# Altium schematic sheet BW1098OBC_Power_Supply.SchDoc: =project_title
size Tabloid; PageSetup: Record=PageOptions|CenterHorizontal=True|CenterVertical=True|PrintScale=0.73|XCorrection=1.00|YCorrection=1.00|PrintKind=0|BorderSize=5000000|LeftOffset=0|BottomOffset=0|Orientation=2|PaperLength=1000|PaperWidth=1000|Scale=100|PaperSource=7|PrintQuality=-4|MediaType=1|DitherType=10|PaperKind=A4|PrintScaleMode=1; CompanyName: Luxonis Holding; Organization: Luxonis Holding; Address1: 1925 Harmony Park Drive; Address2: Westminster, CO; Address3: 80234; Address4: United States; SheetNumber: 5; SheetTotal: 8
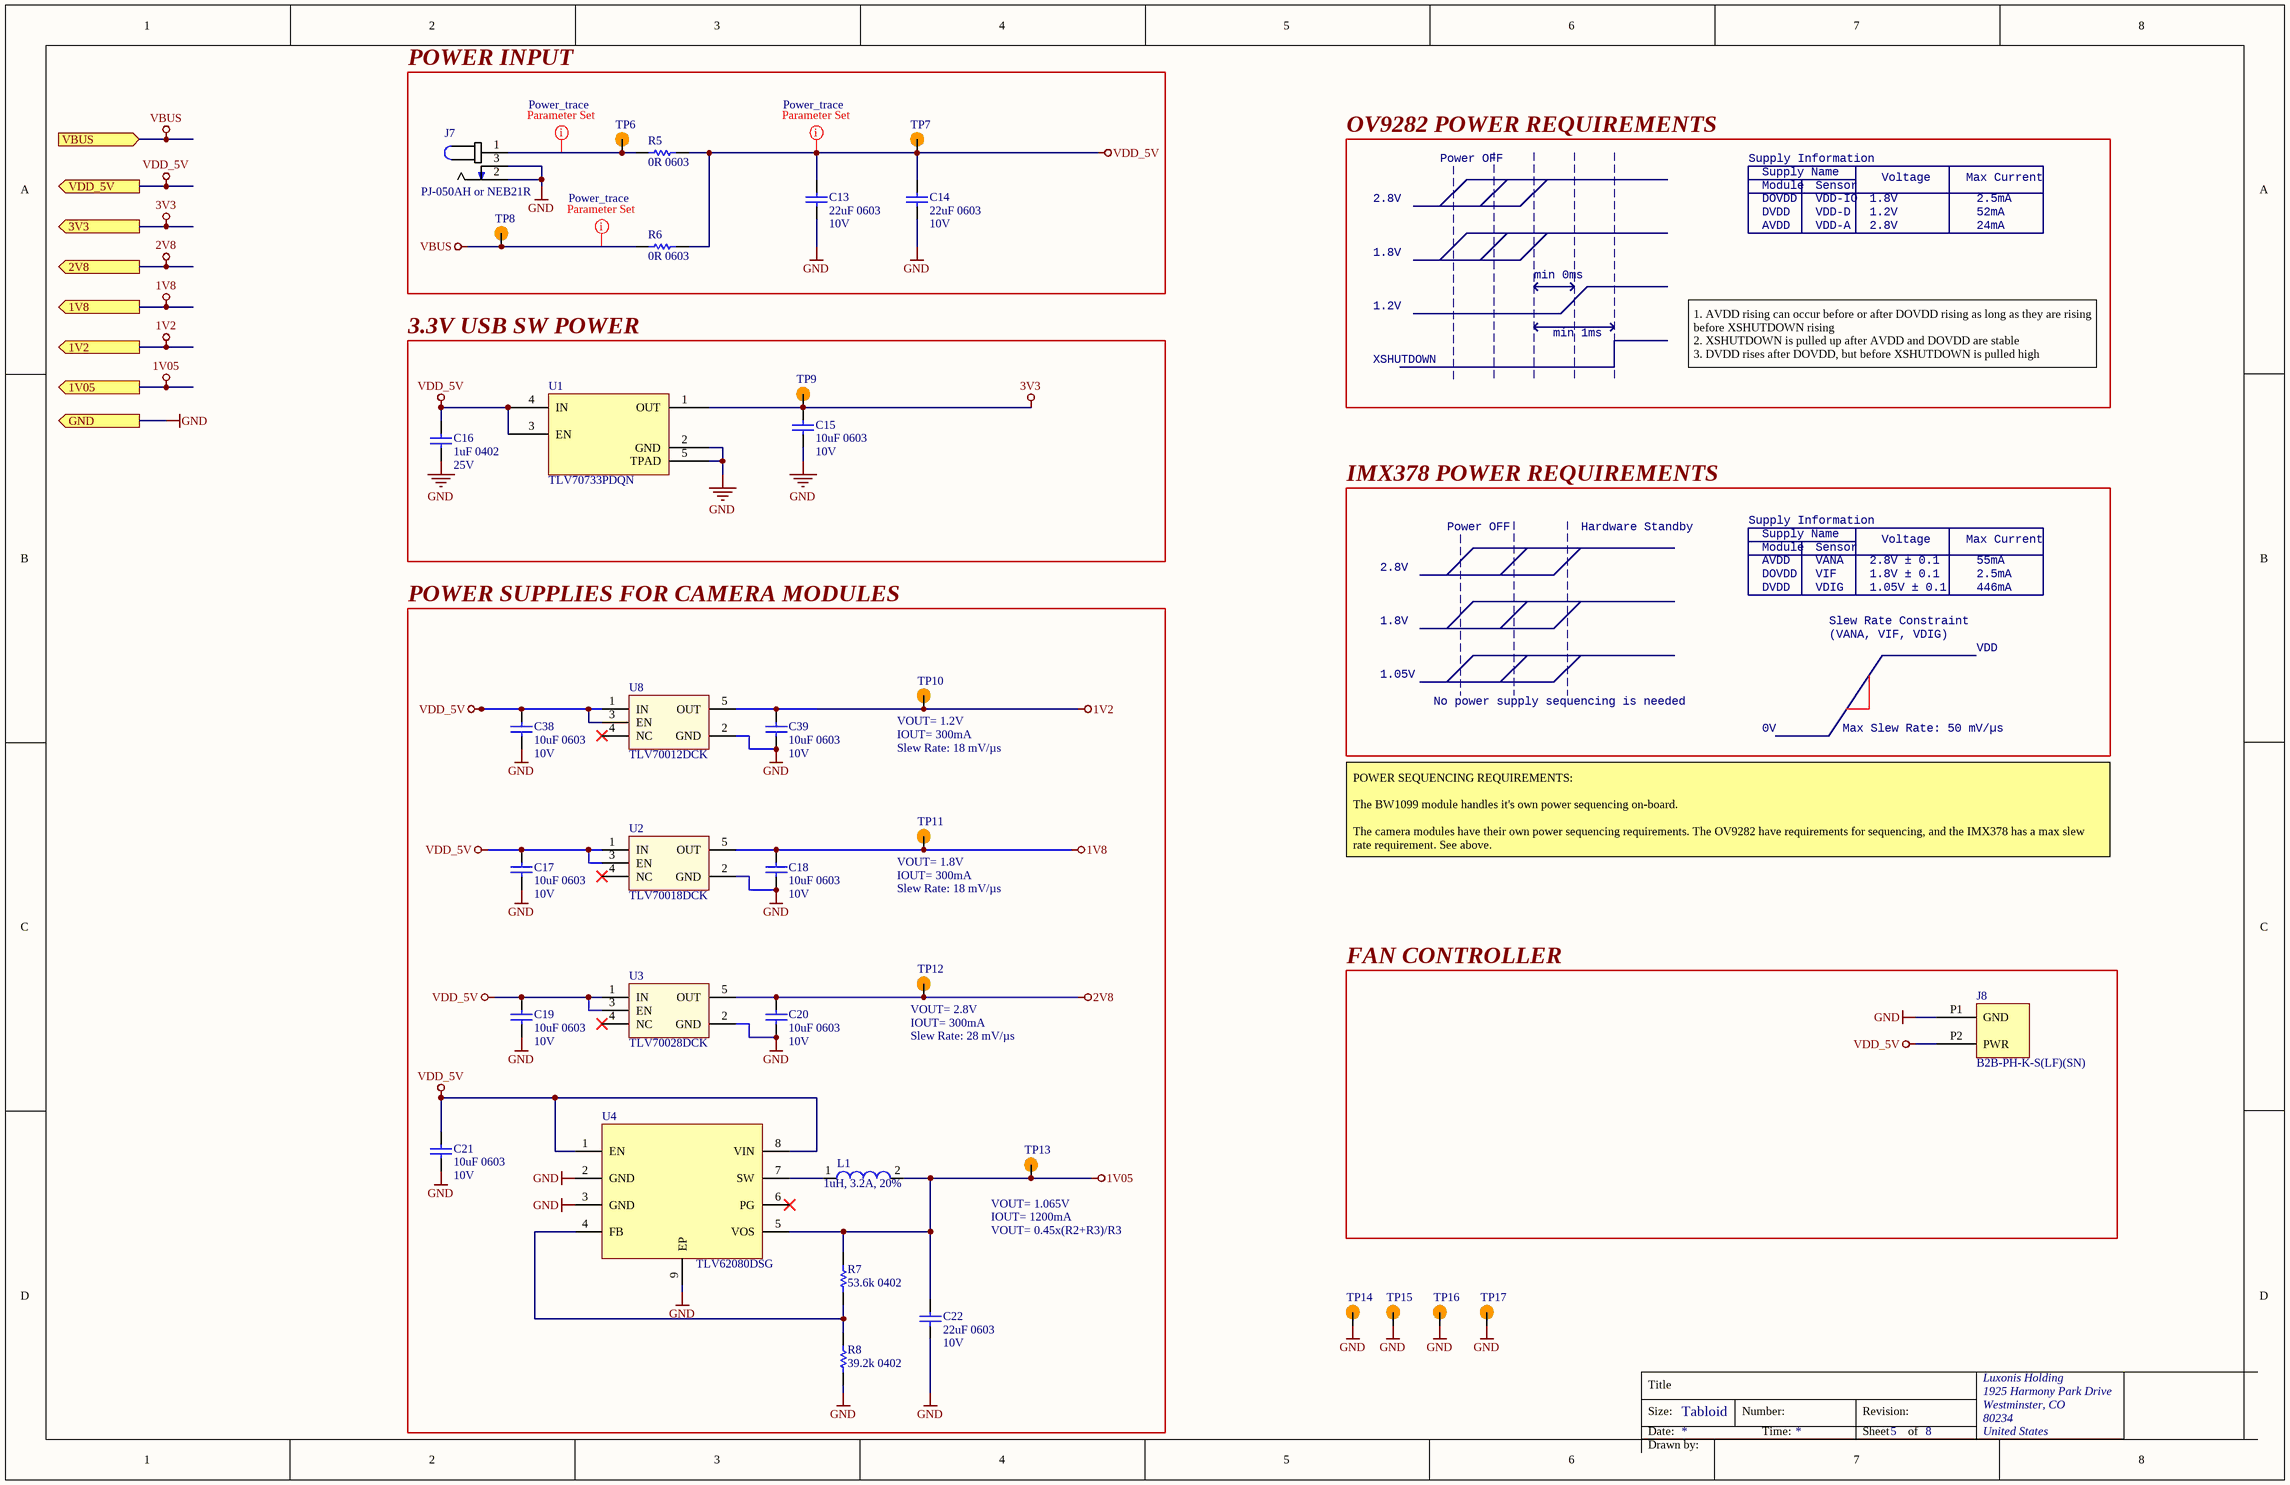
[diagram p0: BW1098OBC_Power_Supply.SchDoc]

## Parts
C13  22uF 0603  Voltage Rating: 10V  [CAPC0603(1608)100_L]
C14  22uF 0603  Voltage Rating: 10V  [CAPC0603(1608)100_L]
C15  10uF 0603  Voltage Rating: 10V  [CAPC0603(1608)100_L]
C16  1uF 0402  Voltage Rating: 25V  [CAPC0402(1005)70_L]
C17  10uF 0603  Voltage Rating: 10V  [CAPC0603(1608)100_L]
C18  10uF 0603  Voltage Rating: 10V  [CAPC0603(1608)100_L]
C19  10uF 0603  Voltage Rating: 10V  [CAPC0603(1608)100_L]
C20  10uF 0603  Voltage Rating: 10V  [CAPC0603(1608)100_L]
C21  10uF 0603  Voltage Rating: 10V  [CAPC0603(1608)100_L]
C22  22uF 0603  Voltage Rating: 10V  [CAPC0603(1608)100_L]
C38  10uF 0603  Voltage Rating: 10V  [CAPC0603(1608)100_L]
C39  10uF 0603  Voltage Rating: 10V  [CAPC0603(1608)100_L]
J7  PJ-050AH or NEB21R  [PJ-050AH/NEB21R_COMBO]
J8  B2B-PH-K-S(LF)(SN)  [B2B-PH-K-S(LF)(SN)]
L1  1uH, 3.2A, 20%  [DFE252012P-1R0M=P2]
R5  0R 0603  [RESC0603(1608)_N]
R6  0R 0603  [RESC0603(1608)_N]
R7  53.6k 0402  [RESC0402(1005)_L]
R8  39.2k 0402  [RESC0402(1005)_L]
TP6  TP100_200_NS  [TP100_200_NS]  (value not drawn)  (no BOM)
TP7  TP100_200_NS  [TP100_200_NS]  (value not drawn)  (no BOM)
TP8  TP100_200_NS  [TP100_200_NS]  (value not drawn)  (no BOM)
TP9  TP100_200_NS  [TP100_200_NS]  (value not drawn)  (no BOM)
TP10  TP100_200_NS  [TP100_200_NS]  (value not drawn)  (no BOM)
TP11  TP100_200_NS  [TP100_200_NS]  (value not drawn)  (no BOM)
TP12  TP100_200_NS  [TP100_200_NS]  (value not drawn)  (no BOM)
TP13  TP100_200_NS  [TP100_200_NS]  (value not drawn)  (no BOM)
TP14  TP100_200_NS  [TP100_200_NS]  (value not drawn)  (no BOM)
TP15  TP100_200_NS  [TP100_200_NS]  (value not drawn)  (no BOM)
TP16  TP100_200_NS  [TP100_200_NS]  (value not drawn)  (no BOM)
TP17  TP100_200_NS  [TP100_200_NS]  (value not drawn)  (no BOM)
U1  TLV70733PDQN  [TLV70733PDQN]
U2  TLV70018DCK  [TLV70018DCK]
U3  TLV70028DCK  [TLV70028DCK]
U4  TLV62080DSG  [TLV62080DSG]
U8  TLV70012DCK  [TLV70012DCK]

## Blocks framed on the sheet
POWER INPUT: C13 C14 J7 R5 R6 TP6-TP8
3.3V USB SW POWER: C15 C16 TP9 U1
POWER SUPPLIES FOR CAMERA MODULES: C17-C22 C38 C39 L1 R7 R8 TP10-TP13 U2-U4 U8
FAN CONTROLLER: J8

## Ports
1V2 (out), 1V05 (out), 1V8 (out), 2V8 (out), 3V3 (out), GND (out), VBUS (in), VDD_5V (out)

## Nets
1V2: C39.2 TP10.1 U8.5(OUT) ; port 1V2
1V05: C22.2 L1.2 R7.2 TP13.1 U4.5(VOS) ; port 1V05
1V8: C18.2 TP11.1 U2.5(OUT) ; port 1V8
2V8: C20.2 TP12.1 U3.5(OUT) ; port 2V8
3V3: C15.2 TP9.1 U1.1(OUT) ; port 3V3
GND: C13.1 C14.1 C15.1 C16.1 C17.1 C18.1 C19.1 C20.1 C21.1 C22.1 C38.1 C39.1 J7.2 J7.3 J8.P1(GND) R8.1 TP14.1 TP15.1 TP16.1 TP17.1 U1.2(GND) U1.5(TPAD) U2.2(GND) U3.2(GND) U4.2(GND) U4.3(GND) U4.9(EP) U8.2(GND) ; port GND
VBUS: R6.1 TP8.1 ; port VBUS
VDD_5V: C13.2 C14.2 C16.2 C17.2 C19.2 C21.2 C38.2 J8.P2(PWR) R5.2 R6.2 TP7.1 U1.3(EN) U1.4(IN) U2.1(IN) U2.3(EN) U3.1(IN) U3.3(EN) U4.1(EN) U4.8(VIN) U8.1(IN) U8.3(EN) ; port VDD_5V
NetJ7_1: J7.1 R5.1 TP6.1
NetL1_1: L1.1 U4.7(SW)
NetR7_1: R7.1 R8.2 U4.4(FB)

Not connected (* = marked no-connect by the designer): U2 4(NC)*; U3 4(NC)*; U4 6(PG)*; U8 4(NC)*

## Layout directives
net class Power_trace: NetJ7_1, VBUS, VDD_5V

## Notes on the sheet
- OV9282 POWER REQUIREMENTS
- Power OFF
- Supply Information
- 2.8V
- AVDD
- DOVDD
- DVDD
- Supply Name
- Module
- VDD-A
- VDD-IO
- VDD-D
- Sensor
- 1.8V
- 1.2V
- Voltage
- Max Current
- 24mA
- 2.5mA
- 52mA
- min 0ms
- XSHUTDOWN
- min 1ms
- 1. AVDD rising can occur before or after DOVDD rising as long as they are rising before XSHUTDOWN rising
  2. XSHUTDOWN is pulled up after AVDD and DOVDD are stable
  3. DVDD rises after DOVDD, but before XSHUTDOWN is pulled high
- IMX378 POWER REQUIREMENTS
- Hardware Standby
- VANA
- 2.8V ± 0.1
- 55mA
- VIF
- VDIG
- Slew Rate Constraint
- 1.8V ± 0.1
- 1.05V ± 0.1
- 446mA
- 1.05V
- No power supply sequencing is needed
- (VANA, VIF, VDIG)
- VDD
- (near TP10) VOUT= 1.2V
- (near TP10) IOUT= 300mA
- (near TP10) Slew Rate: 18 mV/µs
- 0V
- Max Slew Rate: 50 mV/µs
- (near TP11) VOUT= 1.8V
- (near TP11) IOUT= 300mA
- (near TP11) Slew Rate: 18 mV/µs
- POWER SEQUENCING REQUIREMENTS:
  The BW1099 module handles it's own power sequencing on-board.
  The camera modules have their own power sequencing requirements. The OV9282 have requirements for sequencing, and the IMX378 has a max slew rate requirement. See above.
- (near TP12) VOUT= 2.8V
- (near TP12) IOUT= 300mA
- (near TP12) Slew Rate: 28 mV/µs
- (near TP13) VOUT= 1.065V
- (near TP13) IOUT= 1200mA
- VOUT= 0.45x(R2+R3)/R3
- Title
- Size:
- Date:
- Tabloid
- Number:
- Time:
- Revision:
- Sheet
- of
- Drawn by:

## Library data of the parts
C13 C14 C22 = GRM188R61A226ME15D: CAP CER 22UF 10V X5R 0603 20%; Manufacturer 1: Murata; Material: Ceramic; ComponentLink1URL: https://datasheet.ciiva.com/46444/1769893-46444975.pdf?src-supplier=Element14; ComponentLink1Description: https://datasheet.ciiva.com/46444/1769893-46444975.pdf?src-supplier=Element14; Supplier 1: Digi-Key; Manufacturer Part Number 1: GRM188R61A226ME15D; Stock 1: 984716; Pricing 1: 1=0.31000, 10=0.21500, 100=0.12160, 500=0.08584, 1000=0.07512 (USD); RoHS: Yes; Mount: Surface Mount; Case/Package: 0603; Weight: 0.000222oz; Case Code (Metric): 1608; Case Code (Imperial): 0603; Min Operating Temperature: -55°C; Max Operating Temperature: 85°C; Capacitance: 22uF; Tolerance: 20%; Packaging: Tape and Reel; Dielectric: X5R; Voltage Rating (DC): 10V; Termination: SMD/SMT; Package Quantity: 4000; Length: 1.6mm; Height: 0.8mm; Width: 0.8mm; Thickness: 0.039inch; Depth: 0.8mm; REACH SVHC: No SVHC; Lead Free: Lead Free; Supplier Part Number 1: 490-10476-1-ND
C15 C17-C21 C38 C39 = GRM188R61A106ME69D: CAP CER 10UF 10V X5R 0603 20%; Manufacturer 1: Murata; Material: Ceramic; Supplier 1: Digi-Key; Manufacturer Part Number 1: GRM188R61A106ME69D; Stock 1: 2873098; Pricing 1: 1=0.21000, 10=0.14100, 100=0.07130, 500=0.04876, 1000=0.04313 (USD); RoHS: Yes; Mount: Surface Mount; Case/Package: 0603; Weight: 0.000222oz; Case Code (Metric): 1608; Case Code (Imperial): 0603; Min Operating Temperature: -55°C; Max Operating Temperature: 85°C; Packaging: Tape and Reel; Tolerance: 20%; Capacitance: 10uF; Dielectric: X5R; Voltage Rating (DC): 10V; Package Quantity: 4000; Termination: SMD/SMT; Length: 1.6mm; Height: 0.8mm; Width: 0.8mm; Thickness: 0.035inch; Depth: 0.8mm; REACH SVHC: Unknown; Lead Free: Lead Free; ComponentLink1URL: http://www.mouser.com/ds/2/281/c02e-2905.pdf?src-supplier=Mouser; ComponentLink1Description: http://www.mouser.com/ds/2/281/c02e-2905.pdf?src-supplier=Mouser; ComponentLink2URL: http://components.arrow.com/part/dataview/0323_06119472?src-supplier=Arrow+Europe; ComponentLink2Description: http://components.arrow.com/part/dataview/0323_06119472?src-supplier=Arrow+Europe; ComponentLink3URL: http://www.farnell.com/datasheets/2048014.pdf?src-supplier=Farnell; ComponentLink3Description: http://www.farnell.com/datasheets/2048014.pdf?src-supplier=Farnell; ComponentLink4URL: http://www.farnell.com/datasheets/1872210.pdf?src-supplier=Farnell; ComponentLink4Description: http://www.farnell.com/datasheets/1872210.pdf?src-supplier=Farnell; ComponentLink5URL: http://search.murata.co.jp/Ceramy/image/img/A01X/G101/ENG/GRM188R61A106ME69-01.pdf?src-supplier=Digi-Key; ComponentLink5Description: http://search.murata.co.jp/Ceramy/image/img/A01X/G101/ENG/GRM188R61A106ME69-01.pdf?src-supplier=Digi-Key; ComponentLink6URL: http://www.farnell.com/datasheets/1872210.pdf?src-supplier=Newark; ComponentLink6Description: http://www.farnell.com/datasheets/1872210.pdf?src-supplier=Newark; ComponentLink7URL: http://www.farnell.com/datasheets/2048014.pdf?src-supplier=Element14; ComponentLink7Description: http://www.farnell.com/datasheets/2048014.pdf?src-supplier=Element14; ComponentLink8URL: http://www.farnell.com/datasheets/2048014.pdf?src-supplier=Newark; ComponentLink8Description: http://www.farnell.com/datasheets/2048014.pdf?src-supplier=Newark; Supplier Part Number 1: 490-10475-1-ND
C16 = GRM155R61E105KA12D: CAP CER 1UF 25V X5R 0402 10%; Manufacturer 1: Murata; Material: Ceramic; Supplier 1: Digi-Key; Manufacturer Part Number 1: GRM155R61E105KA12D; Stock 1: 200653; Pricing 1: 1=0.10000, 10=0.07100, 100=0.03350, 500=0.02352, 1000=0.01947, 2500=0.01812, 5000=0.01658 (USD); RoHS: Yes; Mount: Surface Mount; Case/Package: 0402; Weight: 0.000212oz; Case Code (Metric): 1005; Case Code (Imperial): 0402; Min Operating Temperature: -55°C; Max Operating Temperature: 85°C; Tolerance: 10%; Capacitance: 1uF; Dielectric: X5R; Voltage Rating (DC): 25V; Packaging: Tape and Reel; Package Quantity: 10000; Termination: SMD/SMT; Voltage: 25V; Length: 1mm; Height: 0.5mm; Width: 0.5mm; Thickness: 0.022inch; Depth: 0.5mm; Lead Free: Lead Free; REACH SVHC: No SVHC; ComponentLink1URL: https://datasheet.ciiva.com/22732/1666664-22732122.pdf?src-supplier=Element14; ComponentLink1Description: https://datasheet.ciiva.com/22732/1666664-22732122.pdf?src-supplier=Element14; ComponentLink2URL: https://datasheet.ciiva.com/7719/1666664-7719006.pdf?src-supplier=Element14; ComponentLink2Description: https://datasheet.ciiva.com/7719/1666664-7719006.pdf?src-supplier=Element14; Supplier Part Number 1: 490-10017-1-ND
J7 = PJ-050AH/NEB21R_COMBO: CONN POWER PIN 2 POS RA PTH Barrel jack 2.1mm x 5.5mm combo footprint; Manufacturer 1: CUI; Gender: Male; Shielding: Unshielded; Current Rating: 5A; Voltage Rating: 24V; Insulation Resistance: 100MR; Number of Conductors: 2; Max Current Rating: 3A; Voltage Rating (DC): 12V; Number of Ports: 1; Inside Diameter: 6mm; Supplier 1: Mouser; Manufacturer Part Number 1: PJ-050AH; Stock 1: 2665; Pricing 1: 1=0.78000, 10=0.68800, 50=0.62100, 100=0.59400, 1000=0.43200, 10000=0.39100 (USD); Mount: Through Hole; Color: Black; Contact Material: Copper; Contact Plating: Nickel; Housing Color: Black; Housing Material: Thermoplastic; Min Operating Temperature: -25°C; Max Operating Temperature: 85°C; Package Quantity: 500; Termination: Solder; Connector Type: Jack; Contact Gender: Male; Orientation: Horizontal; Lead Free: Lead Free; Flammability Rating: UL94 V-0; ComponentLink1URL: http://www.mouser.com/ds/2/670/PJ-050AH-524150.pdf?src-supplier=Mouser; ComponentLink1Description: http://www.mouser.com/ds/2/670/PJ-050AH-524150.pdf?src-supplier=Mouser; ComponentLink2URL: https://www.cui.com/product/resource/digikeypdf/pj-050ah.pdf?src-supplier=Digi-Key; ComponentLink2Description: https://www.cui.com/product/resource/digikeypdf/pj-050ah.pdf?src-supplier=Digi-Key; ComponentLink3URL: http://datasheet.octopart.com/PJ-050AH-CUI-datasheet-15696426.pdf?src-supplier=CUI; ComponentLink3Description: http://datasheet.octopart.com/PJ-050AH-CUI-datasheet-15696426.pdf?src-supplier=CUI; ComponentLink4URL: http://datasheet.octopart.com/PJ-050AH-CUI-datasheet-62089837.pdf?src-supplier=CUI; ComponentLink4Description: http://datasheet.octopart.com/PJ-050AH-CUI-datasheet-62089837.pdf?src-supplier=CUI; ComponentLink5URL: http://datasheet.octopart.com/PJ-050AH-CUI-datasheet-65972796.pdf?src-supplier=CUI; ComponentLink5Description: http://datasheet.octopart.com/PJ-050AH-CUI-datasheet-65972796.pdf?src-supplier=CUI; ComponentLink6URL: http://datasheet.octopart.com/PJ-050AH-CUI-datasheet-103766550.pdf?src-supplier=CUI; ComponentLink6Description: http://datasheet.octopart.com/PJ-050AH-CUI-datasheet-103766550.pdf?src-supplier=CUI; ComponentLink7URL: http://datasheet.octopart.com/PJ-050AH-CUI-datasheet-103111417.pdf?src-supplier=Electro+Sonic; ComponentLink7Description: http://datasheet.octopart.com/PJ-050AH-CUI-datasheet-103111417.pdf?src-supplier=Electro+Sonic; ComponentLink8URL: http://datasheet.octopart.com/PJ-050AH-CUI-datasheet-34390405.pdf?src-supplier=Future+Electronics; ComponentLink8Description: http://datasheet.octopart.com/PJ-050AH-CUI-datasheet-34390405.pdf?src-supplier=Future+Electronics; ComponentLink9URL: http://datasheet.octopart.com/PJ-050AH-CUI-datasheet-62073522.pdf?src-supplier=Future+Electronics; ComponentLink9Description: http://datasheet.octopart.com/PJ-050AH-CUI-datasheet-62073522.pdf?src-supplier=Future+Electronics; ComponentLink10URL: http://datasheet.octopart.com/PJ-050AH-CUI-datasheet-102985732.pdf?src-supplier=Future+Electronics; ComponentLink10Description: http://datasheet.octopart.com/PJ-050AH-CUI-datasheet-102985732.pdf?src-supplier=Future+Electronics; Supplier 2: Newark; Manufacturer 2: Lumberg; Manufacturer Part Number 2: NEB 21 R; Stock 2: 56; Pricing 2: 1=0.86400, 25=0.82100, 50=0.78300, 100=0.72900, 250=0.68600 (USD); Number of Pins: 2; Number of Terminals: 3; Packaging: Bulk; Max Voltage Rating (DC): 12V; Voltage Rating (AC): 12V; Length: 9mm; Depth: 14.5mm; REACH SVHC: No SVHC; ComponentLink11URL: https://datasheet.ciiva.com/11720/0900766b805694d6-11720273.pdf?src-supplier=RSComponents; ComponentLink11Description: https://datasheet.ciiva.com/11720/0900766b805694d6-11720273.pdf?src-supplier=RSComponents; ComponentLink12URL: https://datasheet.ciiva.com/1115/28897-1115898.pdf?src-supplier=Newark; ComponentLink12Description: https://datasheet.ciiva.com/1115/28897-1115898.pdf?src-supplier=Newark; ComponentLink13URL: https://datasheet.ciiva.com/8066/1700582-8066298.pdf?src-supplier=Element14; ComponentLink13Description: https://datasheet.ciiva.com/8066/1700582-8066298.pdf?src-supplier=Element14; ComponentLink14URL: https://datasheet.ciiva.com/29365/738882-da-01-ml-netzger-einbaukuppl-neb-21-r-de-en-fr-29365351.pdf?src-supplier=Conrad; ComponentLink14Description: https://datasheet.ciiva.com/29365/738882-da-01-ml-netzger-einbaukuppl-neb-21-r-de-en-fr-29365351.pdf?src-supplier=Conrad; ComponentLink15URL: http://datasheet.octopart.com/NEB-21-R-Lumberg-datasheet-15206778.pdf?src-supplier=Newark; ComponentLink15Description: http://datasheet.octopart.com/NEB-21-R-Lumberg-datasheet-15206778.pdf?src-supplier=Newark; ComponentLink16URL: http://datasheet.octopart.com/NEB-21-R-Lumberg-datasheet-103789672.pdf?src-supplier=Farnell; ComponentLink16Description: http://datasheet.octopart.com/NEB-21-R-Lumberg-datasheet-103789672.pdf?src-supplier=Farnell; ComponentLink17URL: http://datasheet.octopart.com/NEB-21-R-Lumberg-datasheet-136395310.pdf?src-supplier=Toby+Electronics; ComponentLink17Description: http://datasheet.octopart.com/NEB-21-R-Lumberg-datasheet-136395310.pdf?src-supplier=Toby+Electronics; Supplier Part Number 1: 490-PJ-050AH; Supplier Part Number 2: 97K6458
J8 = B2B-PH-K-S(LF)(SN): CONN HEADER VERT 2POS 2MM; Manufacturer: JST; Number of Positions: 2; Connector Type: Male Pin; Current Rating: 2A; Gender: Male; Contact Resistance: 20mR; Insulation Resistance: 1MR; Voltage Rating: 100V; Supplier 1: Digi-Key; Manufacturer Part Number: B2B-PH-K-S(LF)(SN); Stock 1: 216199; Pricing 1: 1 = 0.170000, 10 = 0.162000, 100 = 0.100200, 500 = 0.082880, 1000 = 0.072520, 5000 = 0.062160, 10000 = 0.060440 (USD); RoHS: Yes; Mount: Through Hole; Number of Pins: 2; Contact Plating: Tin; Color: Natural; Contact Material: Brass; Housing Material: Polyamide; Housing Color: White; Min Operating Temperature: -25°C; Max Operating Temperature: 85°C; Number of Rows: 1; Packaging: Bulk; Termination: Solder; Fastening Type: Detent; Number of Poles: 2; Number of Contacts: 2; Orientation: Straight; Max Current Rating: 2A; Max Voltage Rating (AC): 100V; Voltage Rating (AC): 100V; Working Voltage: 100V; Max Voltage Rating (DC): 100V; Length: 5.9mm; Height: 9.4mm; Pitch: 2mm; Width: 4.5mm; Contact Mating Length: 0.13inch; Depth: 4.5mm; Lead Pitch: 2mm; Lead Free: Lead Free; REACH SVHC: No SVHC; ComponentLink1URL: https://datasheet.ciiva.com/6747/80560-6747392.pdf?src-supplier=Newark; ComponentLink1Description: https://datasheet.ciiva.com/6747/80560-6747392.pdf?src-supplier=Newark; ComponentLink2URL: https://datasheet.ciiva.com/11746/0900766b8082f551-11746676.pdf?src-supplier=RSComponents; ComponentLink2Description: https://datasheet.ciiva.com/11746/0900766b8082f551-11746676.pdf?src-supplier=RSComponents; ComponentLink3URL: https://datasheet.ciiva.com/8052/80560-8052022.pdf?src-supplier=Element14; ComponentLink3Description: https://datasheet.ciiva.com/8052/80560-8052022.pdf?src-supplier=Element14; ComponentLink4URL: https://datasheet.ciiva.com/712/eph-712442.pdf?src-supplier=Digi-Key; ComponentLink4Description: https://datasheet.ciiva.com/712/eph-712442.pdf?src-supplier=Digi-Key; ComponentLink5URL: https://datasheet.ciiva.com/16422/b2b-ph-k-slfsn-16422715.pdf?src-supplier=Future+Electronics; ComponentLink5Description: https://datasheet.ciiva.com/16422/b2b-ph-k-slfsn-16422715.pdf?src-supplier=Future+Electronics; Supplier Part Number 1: 455-1704-ND
L1 = DFE252012P-1R0M=P2: FIXED IND 1UH 3.2A 42 MOHM SMD; Manufacturer: Murata; Core Material: Ferrite; Current Rating: 4.3A; Shielding: Shielded; Test Frequency: 1MHz; DC Resistance (DCR): 42mR; Manufacturer Part Number: DFE252012P-1R0M=P2; RoHS: Yes; Mount: Surface Mount; Case/Package: 1008; Case Code (Metric): 2520; Min Operating Temperature: -40°C; Max Operating Temperature: 125°C; Packaging: Tape and Reel; Composition: Wirewound; Length: 0.098inch; Width: 0.079inch; Height - Seated (Max): 0.039inch; Depth: 2mm; ComponentLink1URL: http://www.farnell.com/datasheets/2550134.pdf?src-supplier=Farnell; ComponentLink1Description: http://www.farnell.com/datasheets/2550134.pdf?src-supplier=Farnell; ComponentLink2URL: https://www.murata.com/~/media/webrenewal/products/inductor/chip/tokoproducts/wirewoundmetalalloychiptype/m_dfe252012p.ashx?src-supplier=Digi-Key; ComponentLink2Description: https://www.murata.com/~/media/webrenewal/products/inductor/chip/tokoproducts/wirewoundmetalalloychiptype/m_dfe252012p.ashx?src-supplier=Digi-Key; ComponentLink3URL: http://www.murata.com/~/media/webrenewal/products/inductor/chip/tokoproducts/wirewoundmetalalloychiptype/m_dfe252012p.ashx?src-supplier=Digi-Key; ComponentLink3Description: http://www.murata.com/~/media/webrenewal/products/inductor/chip/tokoproducts/wirewoundmetalalloychiptype/m_dfe252012p.ashx?src-supplier=Digi-Key; ComponentLink4URL: http://www.toko.co.jp/products/pdf/inductors/dfe252012p.pdf?src-supplier=Avnet; ComponentLink4Description: http://www.toko.co.jp/products/pdf/inductors/dfe252012p.pdf?src-supplier=Avnet; Supplier 1: Digi-Key; Manufacturer 1: Murata; Manufacturer Part Number 1: DFE252012P-1R0M=P2; Stock 1: 2560; Pricing 1: 1=0.43000, 10=0.37800, 100=0.27030, 500=0.22702, 1000=0.18377 (USD); Supplier Part Number 1: 490-10647-1-ND; Max DC Current: 3.2A; Tolerance: 20%; Case Code (Imperial): 1008; Supplier 2: Digi-Key; Manufacturer 2: Murata; Manufacturer Part Number 2: DFE252012P-1R0M=P2; Stock 2: 95; Pricing 2: 1=0.43000, 10=0.37800, 100=0.27030, 500=0.22702, 1000=0.18377 (USD); Supplier 3: Mouser; Manufacturer 3: Murata; Manufacturer Part Number 3: DFE252012P-1R0M=P2; Stock 3: 667; Pricing 3: 1=0.43000, 10=0.37900, 50=0.37900, 100=0.27000, 1000=0.18400, 10000=0.14600 (USD); Supplier 4: Element14; Manufacturer 4: Murata; Manufacturer Part Number 4: DFE252012P-1R0M=P2; Stock 4: 41; Pricing 4: 1=0.64000, 10=0.56500, 100=0.40500, 500=0.34000, 1000=0.27500 (SGD); Supplier Part Number 4: 2530071; Supplier Part Number 3: 81-DFE252012P-1R0MP2; Supplier Part Number 2: 490-10647-6-ND; Inductance: 1uH
R5 R6 = CRCW06030000Z0EA: RES SMD 0 OHM JUMPER 1/10W 0603 0 Ohms Jumper 0.1W, 1/10W Chip Resistor 0603 (1608 Metric) Automotive AEC-Q200 Thick Film; Manufacturer 1: Vishay; Manufacturer Part Number 1: CRCW0603-0000Z0EA; Resistance: 0mR; Power Rating: 100mW; Voltage Rating: 75V; Temperature Coefficient: 100ppm/°C; Tolerance: 5%; Current Rating: 2A; Supplier 1: Digi-Key; Stock 1: 742743; Pricing 1: 1=0.100000, 10=0.034000, 25=0.024400, 50=0.018600, 100=0.013800, 250=0.010480, 500=0.008400, 1000=0.006180 (USD); RoHS: Yes; Mount: Surface Mount; Case/Package: 0603; Weight: 7.1E-05oz; Contact Plating: Tin,Lead; Case Code (Metric): 1608; Case Code (Imperial): 0603; Min Operating Temperature: -55°C; Max Operating Temperature: 155°C; Composition: Thick Film; Termination: SMD/SMT; Packaging: Tape and Reel; Package Quantity: 1; Number of Terminations: 2; Military Standard: Not; Max Power Dissipation: 100mW; Voltage Rating (DC): 75V; Features: Automotive AEC-Q200; Working Voltage: 75V; Length: 1.55mm; Height: 0.02inch; Width: 0.033inch; Depth: 0.85mm; Radiation Hardening: No; Lead Free: Lead Free; REACH SVHC: Unknown; ComponentLink1URL: https://datasheet.ciiva.com/2461/dcrcwe3-2461968.pdf?src-supplier=Digi-Key; ComponentLink1Description: https://datasheet.ciiva.com/2461/dcrcwe3-2461968.pdf?src-supplier=Digi-Key; ComponentLink2URL: https://datasheet.ciiva.com/2461/dcrcwe3-2461969.pdf?src-supplier=Digi-Key; ComponentLink2Description: https://datasheet.ciiva.com/2461/dcrcwe3-2461969.pdf?src-supplier=Digi-Key; ComponentLink3URL: https://datasheet.ciiva.com/2461/dcrcwe3-2461970.pdf?src-supplier=Digi-Key; ComponentLink3Description: https://datasheet.ciiva.com/2461/dcrcwe3-2461970.pdf?src-supplier=Digi-Key; ComponentLink4URL: https://datasheet.ciiva.com/8340/dcrcwe3-8340197.pdf?src-supplier=Avnet; ComponentLink4Description: https://datasheet.ciiva.com/8340/dcrcwe3-8340197.pdf?src-supplier=Avnet; ComponentLink5URL: https://datasheet.ciiva.com/16941/dcrcw-16941302.pdf?src-supplier=Avnet+Europe; ComponentLink5Description: https://datasheet.ciiva.com/16941/dcrcw-16941302.pdf?src-supplier=Avnet+Europe; ComponentLink6URL: https://datasheet.ciiva.com/16199/dcrcwe3-16199063.pdf?src-supplier=Future+Electronics; ComponentLink6Description: https://datasheet.ciiva.com/16199/dcrcwe3-16199063.pdf?src-supplier=Future+Electronics; ComponentLink7URL: https://datasheet.ciiva.com/16725/70201119-16725175.pdf?src-supplier=Allied+Electronics; ComponentLink7Description: https://datasheet.ciiva.com/16725/70201119-16725175.pdf?src-supplier=Allied+Electronics; ComponentLink8URL: https://datasheet.ciiva.com/26316/fld-crcw-e3-data-en-26316615.pdf?src-supplier=Distrelec; ComponentLink8Description: https://datasheet.ciiva.com/26316/fld-crcw-e3-data-en-26316615.pdf?src-supplier=Distrelec; ComponentLink9URL: https://datasheet.ciiva.com/5544/dcrcwe3-109170-5544344.pdf?src-supplier=Mouser; ComponentLink9Description: https://datasheet.ciiva.com/5544/dcrcwe3-109170-5544344.pdf?src-supplier=Mouser; ComponentLink10URL: https://datasheet.ciiva.com/7841/1720486-7841816.pdf?src-supplier=Element14; ComponentLink10Description: https://datasheet.ciiva.com/7841/1720486-7841816.pdf?src-supplier=Element14; ComponentLink11URL: https://datasheet.ciiva.com/7841/1720486-7841817.pdf?src-supplier=Element14; ComponentLink11Description: https://datasheet.ciiva.com/7841/1720486-7841817.pdf?src-supplier=Element14; ComponentLink12URL: https://datasheet.ciiva.com/7841/125364-7841818.pdf?src-supplier=Element14; ComponentLink12Description: https://datasheet.ciiva.com/7841/125364-7841818.pdf?src-supplier=Element14; ComponentLink13URL: https://datasheet.ciiva.com/16721/70201119-16721450.pdf?src-supplier=Allied+Electronics; ComponentLink13Description: https://datasheet.ciiva.com/16721/70201119-16721450.pdf?src-supplier=Allied+Electronics; Supplier Part Number 1: 541-0.0GCT-ND
R7 = CRCW040253K6FKED: RES SMD 53.6K OHM 1% 1/16W 0402; Manufacturer 1: Vishay; Resistance: 53.6kR; Temperature Coefficient: 100ppm/°C; Power Rating: 63mW; Voltage Rating: 50V; Supplier 1: Digi-Key; Manufacturer Part Number 1: CRCW040253K6FKED; Stock 1: 82953; Pricing 1: 1=0.10000, 10=0.03800, 100=0.01540, 1000=0.00690, 2500=0.00599, 5000=0.00495 (USD); RoHS: Yes; Case/Package: 0402; Number of Pins: 2; Weight: 2.3E-05oz; Case Code (Imperial): 0402; Case Code (Metric): 1005; Contact Plating: Tin; Min Operating Temperature: -55°C; Max Operating Temperature: 155°C; Tolerance: 1%; Packaging: Tape and Reel; Composition: Thick Film; Package Quantity: 10; Number of Terminations: 2; Max Power Dissipation: 63mW; Military Standard: Not; Features: Automotive AEC-Q200; Length: 1mm; Height: 0.016inch; Width: 0.5mm; Depth: 0.5mm; Radiation Hardening: No; REACH SVHC: Unknown; ComponentLink1URL: https://datasheet.ciiva.com/5542/dcrcwe3-109170-5542453.pdf?src-supplier=Mouser; ComponentLink1Description: https://datasheet.ciiva.com/5542/dcrcwe3-109170-5542453.pdf?src-supplier=Mouser; ComponentLink2URL: https://datasheet.ciiva.com/7815/1697337-7815992.pdf?src-supplier=Element14; ComponentLink2Description: https://datasheet.ciiva.com/7815/1697337-7815992.pdf?src-supplier=Element14; ComponentLink3URL: https://datasheet.ciiva.com/7815/1697337-7815993.pdf?src-supplier=Element14; ComponentLink3Description: https://datasheet.ciiva.com/7815/1697337-7815993.pdf?src-supplier=Element14; ComponentLink4URL: https://datasheet.ciiva.com/16208/dcrcwe3-16208556.pdf?src-supplier=Future+Electronics; ComponentLink4Description: https://datasheet.ciiva.com/16208/dcrcwe3-16208556.pdf?src-supplier=Future+Electronics; ComponentLink5URL: https://datasheet.ciiva.com/2464/dcrcwe3-2464093.pdf?src-supplier=Digi-Key; ComponentLink5Description: https://datasheet.ciiva.com/2464/dcrcwe3-2464093.pdf?src-supplier=Digi-Key; ComponentLink6URL: https://datasheet.ciiva.com/2464/dcrcwe3-2464094.pdf?src-supplier=Digi-Key; ComponentLink6Description: https://datasheet.ciiva.com/2464/dcrcwe3-2464094.pdf?src-supplier=Digi-Key; ComponentLink7URL: https://datasheet.ciiva.com/3256/dcrcwe3-3256638.pdf?src-supplier=Avnet; ComponentLink7Description: https://datasheet.ciiva.com/3256/dcrcwe3-3256638.pdf?src-supplier=Avnet; ComponentLink8URL: https://datasheet.ciiva.com/2464/dcrcwe3-2464095.pdf?src-supplier=Digi-Key; ComponentLink8Description: https://datasheet.ciiva.com/2464/dcrcwe3-2464095.pdf?src-supplier=Digi-Key; ComponentLink9URL: https://datasheet.ciiva.com/3256/dcrcwe3-3256639.pdf?src-supplier=Avnet; ComponentLink9Description: https://datasheet.ciiva.com/3256/dcrcwe3-3256639.pdf?src-supplier=Avnet; Supplier Part Number 1: 541-53.6KLCT-ND
R8 = CRCW040239K2FKED: RES SMD 39.2K OHM 1% 1/16W 0402; Manufacturer 1: Vishay; Resistance: 39.2kR; Temperature Coefficient: 100ppm/°C; Power Rating: 63mW; Voltage Rating: 50V; Supplier 1: Digi-Key; Manufacturer Part Number 1: CRCW040239K2FKED; Stock 1: 46258; Pricing 1: 1=0.10000, 10=0.03800, 100=0.01540, 1000=0.00690, 2500=0.00599, 5000=0.00495 (USD); RoHS: Yes; Case/Package: 0402; Number of Pins: 2; Weight: 2.3E-05oz; Case Code (Imperial): 0402; Case Code (Metric): 1005; Contact Plating: Tin; Min Operating Temperature: -55°C; Max Operating Temperature: 155°C; Tolerance: 1%; Packaging: Tape and Reel; Composition: Thick Film; Number of Terminations: 2; Voltage Rating (DC): 50V; Termination: SMD/SMT; Max Power Dissipation: 63mW; Package Quantity: 10; Military Standard: Not; Features: Automotive AEC-Q200; Length: 1mm; Height: 0.35mm; Width: 0.5mm; Depth: 0.5mm; Radiation Hardening: No; Lead Free: Lead Free; REACH SVHC: Unknown; ComponentLink1URL: https://datasheet.ciiva.com/11818/0900766b80d98824-11818068.pdf?src-supplier=RSComponents; ComponentLink1Description: https://datasheet.ciiva.com/11818/0900766b80d98824-11818068.pdf?src-supplier=RSComponents; ComponentLink2URL: https://datasheet.ciiva.com/16882/dcrcwe3-16882152.pdf?src-supplier=Avnet+Europe; ComponentLink2Description: https://datasheet.ciiva.com/16882/dcrcwe3-16882152.pdf?src-supplier=Avnet+Europe; ComponentLink3URL: https://datasheet.ciiva.com/2463/dcrcwe3-2463561.pdf?src-supplier=Digi-Key; ComponentLink3Description: https://datasheet.ciiva.com/2463/dcrcwe3-2463561.pdf?src-supplier=Digi-Key; ComponentLink4URL: https://datasheet.ciiva.com/3256/dcrcwe3-3256469.pdf?src-supplier=Avnet; ComponentLink4Description: https://datasheet.ciiva.com/3256/dcrcwe3-3256469.pdf?src-supplier=Avnet; ComponentLink5URL: https://datasheet.ciiva.com/2463/dcrcwe3-2463559.pdf?src-supplier=Digi-Key; ComponentLink5Description: https://datasheet.ciiva.com/2463/dcrcwe3-2463559.pdf?src-supplier=Digi-Key; ComponentLink6URL: https://datasheet.ciiva.com/2463/dcrcwe3-2463560.pdf?src-supplier=Digi-Key; ComponentLink6Description: https://datasheet.ciiva.com/2463/dcrcwe3-2463560.pdf?src-supplier=Digi-Key; ComponentLink7URL: https://datasheet.ciiva.com/16774/70201119-16774809.pdf?src-supplier=Allied+Electronics; ComponentLink7Description: https://datasheet.ciiva.com/16774/70201119-16774809.pdf?src-supplier=Allied+Electronics; ComponentLink8URL: https://datasheet.ciiva.com/22869/70201119-22869593.pdf?src-supplier=Allied+Electronics; ComponentLink8Description: https://datasheet.ciiva.com/22869/70201119-22869593.pdf?src-supplier=Allied+Electronics; ComponentLink9URL: https://datasheet.ciiva.com/16429/dcrcwe3-16429962.pdf?src-supplier=Future+Electronics; ComponentLink9Description: https://datasheet.ciiva.com/16429/dcrcwe3-16429962.pdf?src-supplier=Future+Electronics; ComponentLink10URL: https://datasheet.ciiva.com/7671/1697337-7671596.pdf?src-supplier=Element14; ComponentLink10Description: https://datasheet.ciiva.com/7671/1697337-7671596.pdf?src-supplier=Element14; ComponentLink11URL: https://datasheet.ciiva.com/7671/1533075-7671772.pdf?src-supplier=Element14; ComponentLink11Description: https://datasheet.ciiva.com/7671/1533075-7671772.pdf?src-supplier=Element14; Supplier Part Number 1: 541-39.2KLCT-ND
TP6-TP17 = TEST_POINT
U1 = TLV70733PDQN: IC REG LINEAR 3.3V 200MA 4X2SON Linear Voltage Regulator IC  1 Output  200mA 4-X2SON (1x1); Manufacturer: Texas Instruments; Manufacturer Part Number: TLV70710DQN; Output Voltage: 1V; Number of Regulators: 1; Min Current Limit: 240mA; Quiescent Current: 25uA; Dropout Voltage: 250mV; RoHS: Yes; Mount: Surface Mount; Min Operating Temperature: -40°C; Max Operating Temperature: 125°C; Output Current: 200mA; Packaging: Tape and Reel; Package Quantity: 3000; Lead Free: Lead Free; ComponentLink1URL: http://www.ti.com/lit/gpn/tlv707?src-supplier=Mouser; ComponentLink1Description: http://www.ti.com/lit/gpn/tlv707?src-supplier=Mouser; ComponentLink2URL: http://www.ti.com/lit/ds/symlink/tlv707.pdf?src-supplier=Digi-Key; ComponentLink2Description: http://www.ti.com/lit/ds/symlink/tlv707.pdf?src-supplier=Digi-Key; Supplier 1: Digi-Key; Supplier Part Number 1: 296-28355-1-ND
U2 = TLV70018DCK: IC REG LINEAR 1.8V 200MA SC70-5 Linear Voltage Regulator IC  1 Output  200mA SC-70-5; Manufacturer 1: Texas Instruments; Manufacturer Part Number 1: TLV70018DCKR; Max Power Dissipation: 320mW; Number of Outputs: 1; Dropout Voltage: 175mV; Max Input Voltage: 5.5V; Min Input Voltage: 2V; Min Current Limit: 220mA; Polarity: Positive; Output Voltage Accuracy: 2%; Quiescent Current: 30uA; Output Type: Fixed; Nominal Supply Current: 31uA; Supplier 1: Digi-Key; Stock 1: 63905; Pricing 1: 1=0.48000, 10=0.40900, 100=0.30570, 500=0.24020, 1000=0.18561 (USD); RoHS: Yes; Case/Package: SC; Number of Pins: 5; Contact Plating: Gold; Min Operating Temperature: -40°C; Max Operating Temperature: 125°C; Packaging: Tape and Reel; Package Quantity: 1; Output Voltage: 1.8V; Output Current: 200mA; Max Output Current: 200mA; Number of Regulators: 1; Power Dissipation: 320mW; Nominal Output Voltage: 1.8V; Accuracy: 2%; Max Output Voltage: 1.8V; Min Output Voltage: 1.8V; REACH SVHC: No SVHC; Lead Free: Lead Free; ComponentLink1URL: https://datasheet.ciiva.com/41462/001014631-da-01-en-ic-reg-ldo-1-8v-0-tlv70018dckr-sot-5-tid-41462480.pdf?src-supplier=Conrad; ComponentLink1Description: https://datasheet.ciiva.com/41462/001014631-da-01-en-ic-reg-ldo-1-8v-0-tlv70018dckr-sot-5-tid-41462480.pdf?src-supplier=Conrad; Supplier 2: Digi-Key; Manufacturer 2: Texas Instruments; Manufacturer Part Number 2: TLV70018DCKT; Stock 2: 13188; Pricing 2: 1=0.55000, 10=0.46700, 100=0.34900 (USD); Power Rating: 320mW; Length: 2.15mm; Height: 1mm; Width: 1.4mm; Radiation Hardening: No; ComponentLink2URL: https://datasheet.ciiva.com/22700/1882059-22700171.pdf?src-supplier=Element14; ComponentLink2Description: https://datasheet.ciiva.com/22700/1882059-22700171.pdf?src-supplier=Element14; ComponentLink3URL: https://datasheet.ciiva.com/14149/tlv700-eng-ds-14149837.pdf?src-supplier=Distrelec; ComponentLink3Description: https://datasheet.ciiva.com/14149/tlv700-eng-ds-14149837.pdf?src-supplier=Distrelec; ComponentLink4URL: https://datasheet.ciiva.com/7992/1882059-7992894.pdf?src-supplier=Element14; ComponentLink4Description: https://datasheet.ciiva.com/7992/1882059-7992894.pdf?src-supplier=Element14; Supplier Part Number 1: 296-32409-1-ND; Supplier Part Number 2: 296-25269-1-ND
U3 = TLV70028DCK: IC REG LINEAR 2.8V 200MA SC70-5 Linear Voltage Regulator IC  1 Output  200mA SC-70-5; Manufacturer 1: Texas Instruments; Manufacturer Part Number 1: TLV70028DCKT; Dropout Voltage: 175mV; Number of Outputs: 1; Max Power Dissipation: 320mW; Max Input Voltage: 5.5V; Min Input Voltage: 2V; Min Current Limit: 220mA; Polarity: Positive; Quiescent Current: 30uA; Accuracy: 2%; Output Type: Fixed; Nominal Supply Current: 31uA; Supplier 1: Digi-Key; Stock 1: 832; Pricing 1: 1=0.55000, 10=0.46700, 100=0.34900 (USD); RoHS: Yes; Case/Package: SC; Number of Pins: 5; Contact Plating: Gold; Min Operating Temperature: -40°C; Max Operating Temperature: 125°C; Package Quantity: 1; Packaging: Tape and Reel; Output Current: 200mA; Output Voltage: 2.8V; Max Output Current: 200mA; Number of Regulators: 1; Power Dissipation: 320mW; Min Output Voltage: 2.8V; Output Voltage Accuracy: 2%; Max Output Voltage: 2.8V; Max Supply Voltage: 5.5V; Min Supply Voltage: 2V; Nominal Output Voltage: 2.8V; Power Rating: 320mW; Termination: SMD/SMT; Length: 2.15mm; Height: 1mm; Width: 1.4mm; Radiation Hardening: No; Lead Free: Lead Free; REACH SVHC: No SVHC; ComponentLink1URL: https://datasheet.ciiva.com/14149/tlv700-eng-ds-14149840.pdf?src-supplier=Distrelec; ComponentLink1Description: https://datasheet.ciiva.com/14149/tlv700-eng-ds-14149840.pdf?src-supplier=Distrelec; ComponentLink2URL: https://datasheet.ciiva.com/22700/1882059-22700172.pdf?src-supplier=Element14; ComponentLink2Description: https://datasheet.ciiva.com/22700/1882059-22700172.pdf?src-supplier=Element14; Supplier 2: Digi-Key; Manufacturer 2: Texas Instruments; Manufacturer Part Number 2: TLV70028DCKR; Stock 2: 30013; Pricing 2: 1=0.48000, 10=0.40900, 100=0.30570, 500=0.24020, 1000=0.18561 (USD); ComponentLink3URL: http://components.arrow.com/part/dataview/0323_00585634?src-supplier=Arrow+Europe; ComponentLink3Description: http://components.arrow.com/part/dataview/0323_00585634?src-supplier=Arrow+Europe; ComponentLink4URL: http://focus.ti.com/lit/ds/symlink/tlv70033.pdf?src-supplier=Avnet+Europe; ComponentLink4Description: http://focus.ti.com/lit/ds/symlink/tlv70033.pdf?src-supplier=Avnet+Europe; ComponentLink5URL: http://www.ti.com/lit/ds/slvsa00d/slvsa00d.pdf?src-supplier=Digi-Key; ComponentLink5Description: http://www.ti.com/lit/ds/slvsa00d/slvsa00d.pdf?src-supplier=Digi-Key; ComponentLink6URL: http://www.ti.com/lit/pdf/slyy050?src-supplier=Digi-Key; ComponentLink6Description: http://www.ti.com/lit/pdf/slyy050?src-supplier=Digi-Key; ComponentLink7URL: http://www.ti.com/general/docs/lit/getliterature.tsp?genericPartNumber=TLV700&&fileType=pdf&src-supplier=Avnet+Asia; ComponentLink7Description: http://www.ti.com/general/docs/lit/getliterature.tsp?genericPartNumber=TLV700&&fileType=pdf&src-supplier=Avnet+Asia; ComponentLink8URL: http://www.ti.com/general/docs/lit/getliterature.tsp?genericPartNumber=TLV700&&fileType=pdf&src-supplier=Avnet; ComponentLink8Description: http://www.ti.com/general/docs/lit/getliterature.tsp?genericPartNumber=TLV700&&fileType=pdf&src-supplier=Avnet; ComponentLink9URL: http://components.arrow.com/part/dataview/48329233S8322732N7713?src-supplier=Arrow; ComponentLink9Description: http://components.arrow.com/part/dataview/48329233S8322732N7713?src-supplier=Arrow; ComponentLink10URL: http://www.ti.com/litv/slvsa00d?src-supplier=Mouser; ComponentLink10Description: http://www.ti.com/litv/slvsa00d?src-supplier=Mouser; ComponentLink11URL: http://www.ti.com/lit/ds/slvsa00e/slvsa00e.pdf?src-supplier=Digi-Key; ComponentLink11Description: http://www.ti.com/lit/ds/slvsa00e/slvsa00e.pdf?src-supplier=Digi-Key; Supplier Part Number 1: 296-25271-1-ND; Supplier Part Number 2: 296-39279-1-ND
U4 = TLV62080DSG: IC REG BUCK ADJ 1.2A SYNC 8WSON; Manufacturer 1: Texas Instruments; Manufacturer Part Number 1: TLV62080DSGR; Quiescent Current: 30uA; Switching Frequency: 2MHz; Output Voltage: 4V; Number of Outputs: 1; Min Input Voltage: 2.5V; Max Input Voltage: 5.5V; Min Output Voltage: 500mV; Synchronous Rectifier: Yes; Output Type: Adjustable; Output Configuration: Positive; Supplier 1: Digi-Key; Stock 1: 93781; Pricing 1: 1=1.35000, 10=1.20300, 100=0.93810, 500=0.77498, 1000=0.61182 (USD); RoHS: Yes; Mount: Surface Mount; Number of Pins: 8; Contact Plating: Gold; Min Operating Temperature: -40°C; Max Operating Temperature: 125°C; Output Current: 1.2A; Packaging: Tape and Reel; Package Quantity: 3000; Nominal Supply Current: 30uA; Min Supply Voltage: 2.5V; Max Output Current: 1.2A; Max Output Voltage: 4V; Lead Free: Lead Free; ComponentLink1URL: https://datasheet.ciiva.com/6604/tlv62080-6604087.pdf?src-supplier=Digi-Key; ComponentLink1Description: https://datasheet.ciiva.com/6604/tlv62080-6604087.pdf?src-supplier=Digi-Key; ComponentLink2URL: https://datasheet.ciiva.com/14378/tlv62080-14378282.pdf?src-supplier=Avnet; ComponentLink2Description: https://datasheet.ciiva.com/14378/tlv62080-14378282.pdf?src-supplier=Avnet; Supplier 2: Digi-Key; Manufacturer 2: Texas Instruments; Manufacturer Part Number 2: TLV62080DSGT; Stock 2: 6366; Pricing 2: 1=1.48000, 10=1.32700, 100=1.06620 (USD); Radiation Hardening: No; REACH SVHC: No SVHC; ComponentLink3URL: https://datasheet.ciiva.com/29732/tlv62080-29732147.pdf?src-supplier=Digi-Key; ComponentLink3Description: https://datasheet.ciiva.com/29732/tlv62080-29732147.pdf?src-supplier=Digi-Key; ComponentLink4URL: https://datasheet.ciiva.com/29732/tlv62080-29732156.pdf?src-supplier=Digi-Key; ComponentLink4Description: https://datasheet.ciiva.com/29732/tlv62080-29732156.pdf?src-supplier=Digi-Key; ComponentLink5URL: https://datasheet.ciiva.com/29732/tlv62080-29732151.pdf?src-supplier=Digi-Key; ComponentLink5Description: https://datasheet.ciiva.com/29732/tlv62080-29732151.pdf?src-supplier=Digi-Key; ComponentLink6URL: https://datasheet.ciiva.com/14378/tlv62080-14378283.pdf?src-supplier=Avnet; ComponentLink6Description: https://datasheet.ciiva.com/14378/tlv62080-14378283.pdf?src-supplier=Avnet; ComponentLink7URL: https://datasheet.ciiva.com/26104/tlv62080-26104460.pdf?src-supplier=Avnet+Europe; ComponentLink7Description: https://datasheet.ciiva.com/26104/tlv62080-26104460.pdf?src-supplier=Avnet+Europe; Supplier Part Number 1: 296-39270-1-ND; Supplier Part Number 2: 296-36759-1-ND
U8 = TLV70012DCK: IC REG LINEAR 1.2V 200MA SC70-5; Manufacturer 1: Texas Instruments; Manufacturer Part Number 1: TLV70012DCKR; Max Power Dissipation: 320mW; Number of Outputs: 1; Dropout Voltage: 175mV; Max Input Voltage: 5.5V; Min Input Voltage: 2V; Min Current Limit: 220mA; Polarity: Positive; Accuracy: 2%; Quiescent Current: 30uA; Output Type: Fixed; Supplier 1: Digi-Key; Stock 1: 8389; Pricing 1: 1=0.48000, 10=0.40900, 100=0.30570, 500=0.24020, 1000=0.18561 (USD); RoHS: Yes; Case/Package: SC; Number of Pins: 5; Contact Plating: Gold; Min Operating Temperature: -40°C; Max Operating Temperature: 125°C; Output Voltage: 1.2V; Packaging: Tape and Reel; Output Current: 200mA; Package Quantity: 1; Max Output Current: 200mA; Number of Regulators: 1; Power Dissipation: 320mW; Min Output Voltage: 1.2V; Output Voltage Accuracy: 2%; Max Output Voltage: 1.2V; Nominal Output Voltage: 1.2V; Radiation Hardening: No; Lead Free: Lead Free; REACH SVHC: No SVHC; ComponentLink1URL: https://datasheet.ciiva.com/26909/tlv70012dckr-26909420.pdf?src-supplier=IIIC; ComponentLink1Description: https://datasheet.ciiva.com/26909/tlv70012dckr-26909420.pdf?src-supplier=IIIC; ComponentLink2URL: https://datasheet.ciiva.com/46448/1836520-46448747.pdf?src-supplier=Element14; ComponentLink2Description: https://datasheet.ciiva.com/46448/1836520-46448747.pdf?src-supplier=Element14; Supplier Part Number 1: 296-27438-1-ND; Supplier 2: TI store; Manufacturer 2: Texas Instruments; Manufacturer Part Number 2: TLV70012DCKT; Stock 2: 250; Pricing 2: 1=0.43000, 10=0.38000, 25=0.35000, 100=0.30000, 250=0.27000, 500=0.21000, 750=0.16000, 1000=0.14000 (USD); ComponentLink3URL: http://components.arrow.com/part/dataview/48874348S9524109N7713?src-supplier=Arrow; ComponentLink3Description: http://components.arrow.com/part/dataview/48874348S9524109N7713?src-supplier=Arrow; ComponentLink4URL: http://components.arrow.com/part/dataview/0323_02210905?src-supplier=Arrow+Europe; ComponentLink4Description: http://components.arrow.com/part/dataview/0323_02210905?src-supplier=Arrow+Europe; ComponentLink5URL: http://www.ti.com/general/docs/lit/getliterature.tsp?genericPartNumber=TLV700&&fileType=pdf&src-supplier=Avnet; ComponentLink5Description: http://www.ti.com/general/docs/lit/getliterature.tsp?genericPartNumber=TLV700&&fileType=pdf&src-supplier=Avnet; ComponentLink6URL: http://focus.ti.com/lit/ds/symlink/tlv70033.pdf?src-supplier=Avnet; ComponentLink6Description: http://focus.ti.com/lit/ds/symlink/tlv70033.pdf?src-supplier=Avnet; ComponentLink7URL: http://www.ti.com/lit/ds/slvsa00e/slvsa00e.pdf?src-supplier=Digi-Key; ComponentLink7Description: http://www.ti.com/lit/ds/slvsa00e/slvsa00e.pdf?src-supplier=Digi-Key; ComponentLink8URL: http://www.ti.com/litv/slvsa00d?src-supplier=Mouser; ComponentLink8Description: http://www.ti.com/litv/slvsa00d?src-supplier=Mouser; Supplier Part Number 2: TLV70012DCKT